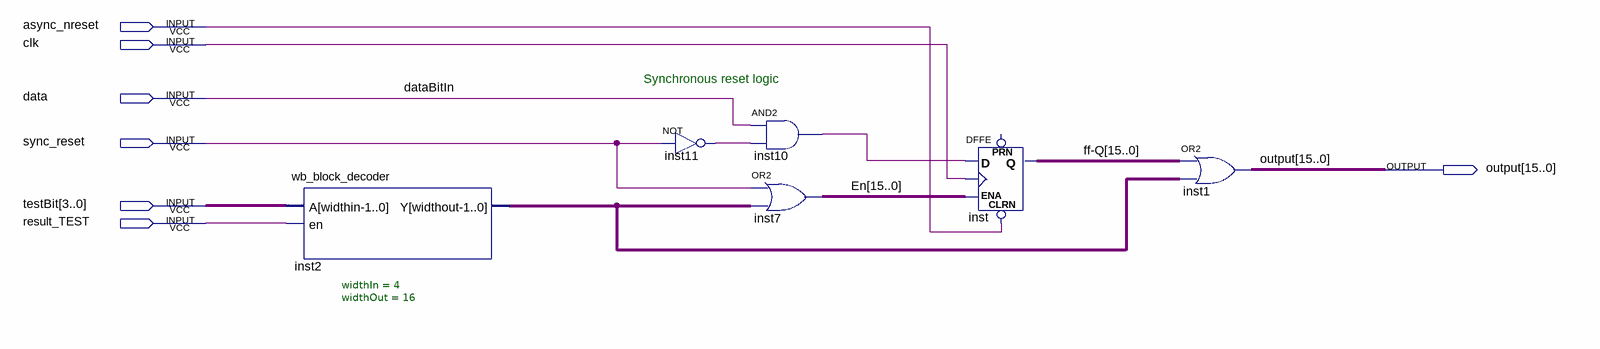
[diagram p0: schematic sheet]
// Quartus schematic wb_aComp_binSearchReg.bdf as structural Verilog: 6 symbols, 7 pins
module wb_aComp_binSearchReg (
  input  async_nreset,
  input  clk,
  input  data,
  input  sync_reset,
  input  [3:0] testBit,
  input  result_TEST,
  output [15:0] \output 
);

  wire inst10_out, inst11_out;
  wire [15:0] En, \ff-Q , inst2_y;

  wb_block_decoder #(.widthIn(4), .widthOut(16)) inst2 (.A(testBit), .en(result_TEST), .Y(inst2_y));
  not inst11 (inst11_out, sync_reset);
  and inst10 (inst10_out, data, inst11_out);
  assign En = {16{sync_reset}} | inst2_y;  // OR2 inst7, 16 bits wide
  DFFE inst[15:0] (.CLRN(async_nreset), .D(inst10_out), .CLK(clk), .ENA(En), .Q(\ff-Q ));  // open: PRN
  assign \output  = \ff-Q  | inst2_y;  // OR2 inst1, 16 bits wide

  // Other names for the same wires on the sheet: dataBitIn = data

  // Notes on the sheet:
  //   Synchronous reset logic
endmodule
